# Altium schematic sheet OLEDMiniFlyNRF.SchDoc: MiniFly
size A4; Author: liujun6037; Revision: 0; Version: V1.32; SheetSize: A4
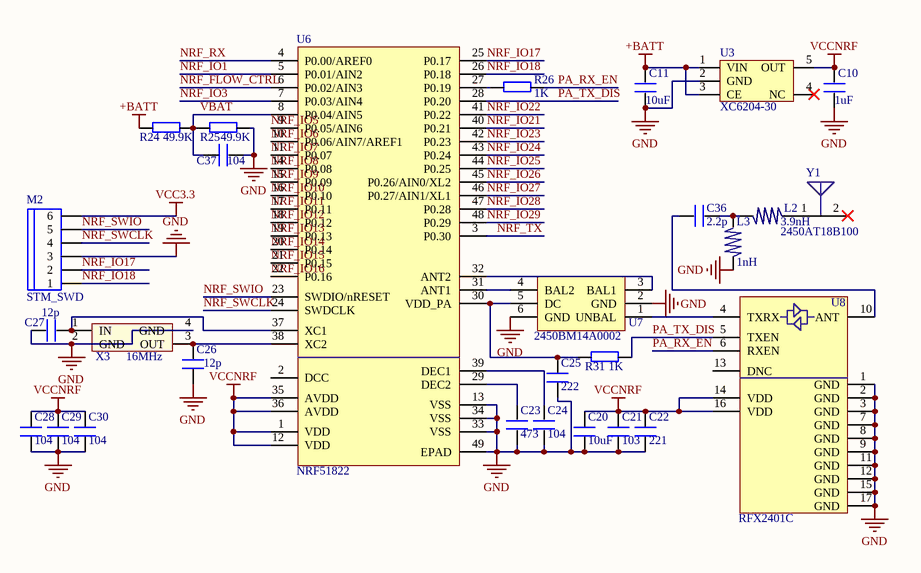
[diagram p0: OLEDMiniFlyNRF.SchDoc]

## Parts
C10  1uF  [C 0603_L]
C11  10uF  [C 0603_L]
C20  10uF  [C 0603_L]
C21  103  [C 0603_L]
C22  221  [C 0603_L]
C23  473  [C 0603_L]
C24  104  [C 0603_L]
C25  222  [C 0603_L]
C26  12p  [C 0603_L]
C27  12p  [C 0603_L]
C28  104  [C 0603_L]
C29  104  [C 0603_L]
C30  104  [C 0603_L]
C36  2.2p  [0402]
C37  104  [C 0603_L]
L2  3.9nH  [0402]
L3  1nH  [0402]
M2  STM_SWD  [SH1.0_6P]
R24  49.9K  [R 0603_L]
R25  49.9K  [R 0603_L]
R26  1K  [R 0603_L]
R31  1K  [R 0603_L]
U3  XC6204-30  [SOT23-5L]
U6  NRF51822  [QFN48M-04]
U7  2450BM14A0002  [0603-6]
U8  RFX2401C  [QFN16M]
X3  16MHz  [OSC32254Pmini]
Y1  2450AT18B100  [L 1206]

## Nets
+BATT: C11.2 R24.2 U3.1(VIN) U3.3(CE)
GND: C10.1 C11.1 C20.2 C21.2 C22.2 C23.2 C24.2 C25.2 C26.1 C27.2 C28.2 C29.2 C30.2 C37.1 L3.2 M2.3 R25.1 U3.2(GND) U6.13(VSS) U6.33(VSS) U6.34(VSS) U6.49(EPAD) U7.2(GND) U7.6(GND) U8.1(GND) U8.2(GND) U8.3(GND) U8.7(GND) U8.8(GND) U8.9(GND) U8.11(GND) U8.12(GND) U8.15(GND) U8.17(GND) X3.2(GND) X3.4(GND)
VCC3.3: M2.6
VCCNRF: C10.2 C20.1 C21.1 C22.1 C28.1 C29.1 C30.1 U3.5(OUT) U6.1(VDD) U6.12(VDD) U6.35(AVDD) U6.36(AVDD) U8.14(VDD) U8.16(VDD)
NRF_FLOW_CTRL: U6.6(P0.02/AIN3)
NRF_IO1: U6.5(P0.01/AIN2)
NRF_IO3: U6.7(P0.03/AIN4)
NRF_IO5: U6.9(P0.05/AIN6)
NRF_IO6: U6.10(P0.06/AIN7/AREF1)
NRF_IO7: U6.11(P0.07)
NRF_IO8: U6.14(P0.08)
NRF_IO9: U6.15(P0.09)
NRF_IO10: U6.16(P0.10)
NRF_IO11: U6.17(P0.11)
NRF_IO12: U6.18(P0.12)
NRF_IO13: U6.19(P0.13)
NRF_IO14: U6.20(P0.14)
NRF_IO15: U6.21(P0.15)
NRF_IO16: U6.22(P0.16)
NRF_IO17: M2.2 U6.25(P0.17)
NRF_IO18: M2.1 U6.26(P0.18)
NRF_IO21: U6.40(P0.21)
NRF_IO22: U6.41(P0.22)
NRF_IO23: U6.42(P0.23)
NRF_IO24: U6.43(P0.24)
NRF_IO25: U6.44(P0.25)
NRF_IO26: U6.45(P0.26/AIN0/XL2)
NRF_IO27: U6.46(P0.27/AIN1/XL1)
NRF_IO28: U6.47(P0.28)
NRF_IO29: U6.48(P0.29)
NRF_RX: U6.4(P0.00/AREF0)
NRF_SWCLK: M2.4 U6.24(SWDCLK)
NRF_SWIO: M2.5 U6.23(SWDIO/nRESET)
NRF_TX: U6.3(P0.30)
PA_RX_EN: R26.1 U8.6(RXEN)
PA_TX_DIS: R31.1 U6.28(P0.20) U8.5(TXEN)
VBAT: C37.2 R24.1 R25.2 U6.8(P0.04/AIN5)
NetC23_1: C23.1 U6.29(DEC2)
NetC24_1: C24.1 U6.39(DEC1)
NetC25_1: C25.1 R31.2 U6.30(VDD_PA) U7.5(DC)
NetC26_2: C26.2 U6.38(XC2) X3.3(OUT)
NetC27_1: C27.1 U6.37(XC1) X3.1(IN)
NetC36_1: C36.1 U8.10(ANT)
NetC36_2: C36.2 L2.2 L3.1
NetL2_1: L2.1 Y1.1(FP)
NetR26_2: R26.2 U6.27(P0.19)
NetU6_31: U6.31(ANT1) U7.4(BAL2)
NetU6_32: U6.32(ANT2) U7.3(BAL1)
NetU7_1: U7.1(UNBAL) U8.4(TXRX)

Not connected (* = marked no-connect by the designer): U3 4(NC)*; U6 2(DCC); U8 13(DNC); Y1 2(NC)*

## Notes on the sheet
- Title
- Size:
- Date:
- A4
- Number:
- Time:
- Revision:
- Sheet
- of
- File:

## Library data of the parts
C10 C11 C20-C30 C36 C37 = C
L2 L3 = L
M2 = HEAD6
R24-R26 R31 = R
U3 = XC6204
U7 = BALUN
X3 = XTAL-无源贴片: 无源贴片晶振
Y1 = CHIP_ANTENNA